# Altium schematic sheet Power.SchDoc
size A4
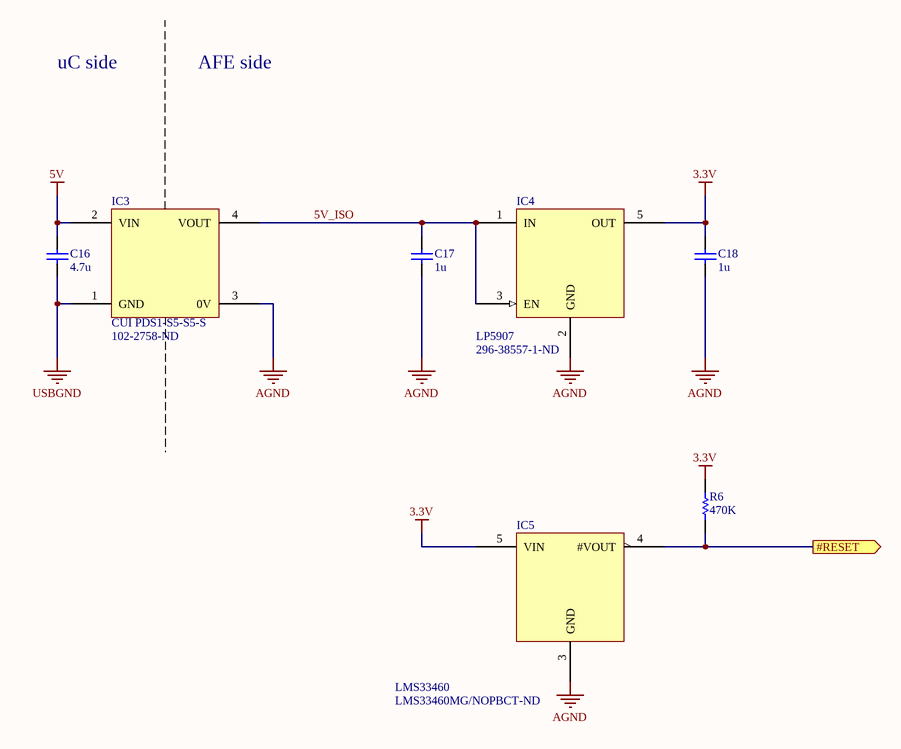
[diagram p0: Power.SchDoc]

## Parts
C16  4.7u  [0805 CAP]
C17  1u  [0805 CAP]
C18  1u  [0805 CAP]
IC3  CUI PDS1-S5-S5-S  Supplier Part Number 1: 102-2758-ND  [SIL4]
IC4  LP5907  Supplier Part Number 1: 296-38557-1-ND  [SOT95P280X145-5N]
IC5  LMS33460  Supplier Part Number 1: LMS33460MG/NOPBCT-ND  [SOT65P210X110-5N]
R6  470K  [0805 Res]

## Ports
#RESET (out)

## Nets
3.3V: C18.2 IC4.5(OUT) IC5.5(VIN) R6.2
5V: C16.2 IC3.2(VIN)
AGND: C17.1 C18.1 IC3.3(0V) IC4.2(GND) IC5.3(GND)
USBGND: C16.1 IC3.1(GND)
5V_ISO: C17.2 IC3.4(VOUT) IC4.1(IN) IC4.3(EN)
#RESET: IC5.4(#VOUT) R6.1 ; port #RESET

## Notes on the sheet
- uC side
- AFE side

## Library data of the parts
C16-C18 = Cap
  C16: Value: 4.7u
  C17 C18: Value: 1u
R6 = Res: Value: 470K
IC3 = CUI PDS1-S5-S5-S: Supplier 1: Digi-Key
IC4 = LP5907: Supplier 1: Digi-Key
IC5 = LMS33460: Supplier 1: Digi-Key